# EAGLE design LEOPADMINI (EAGLE 9.4.2)
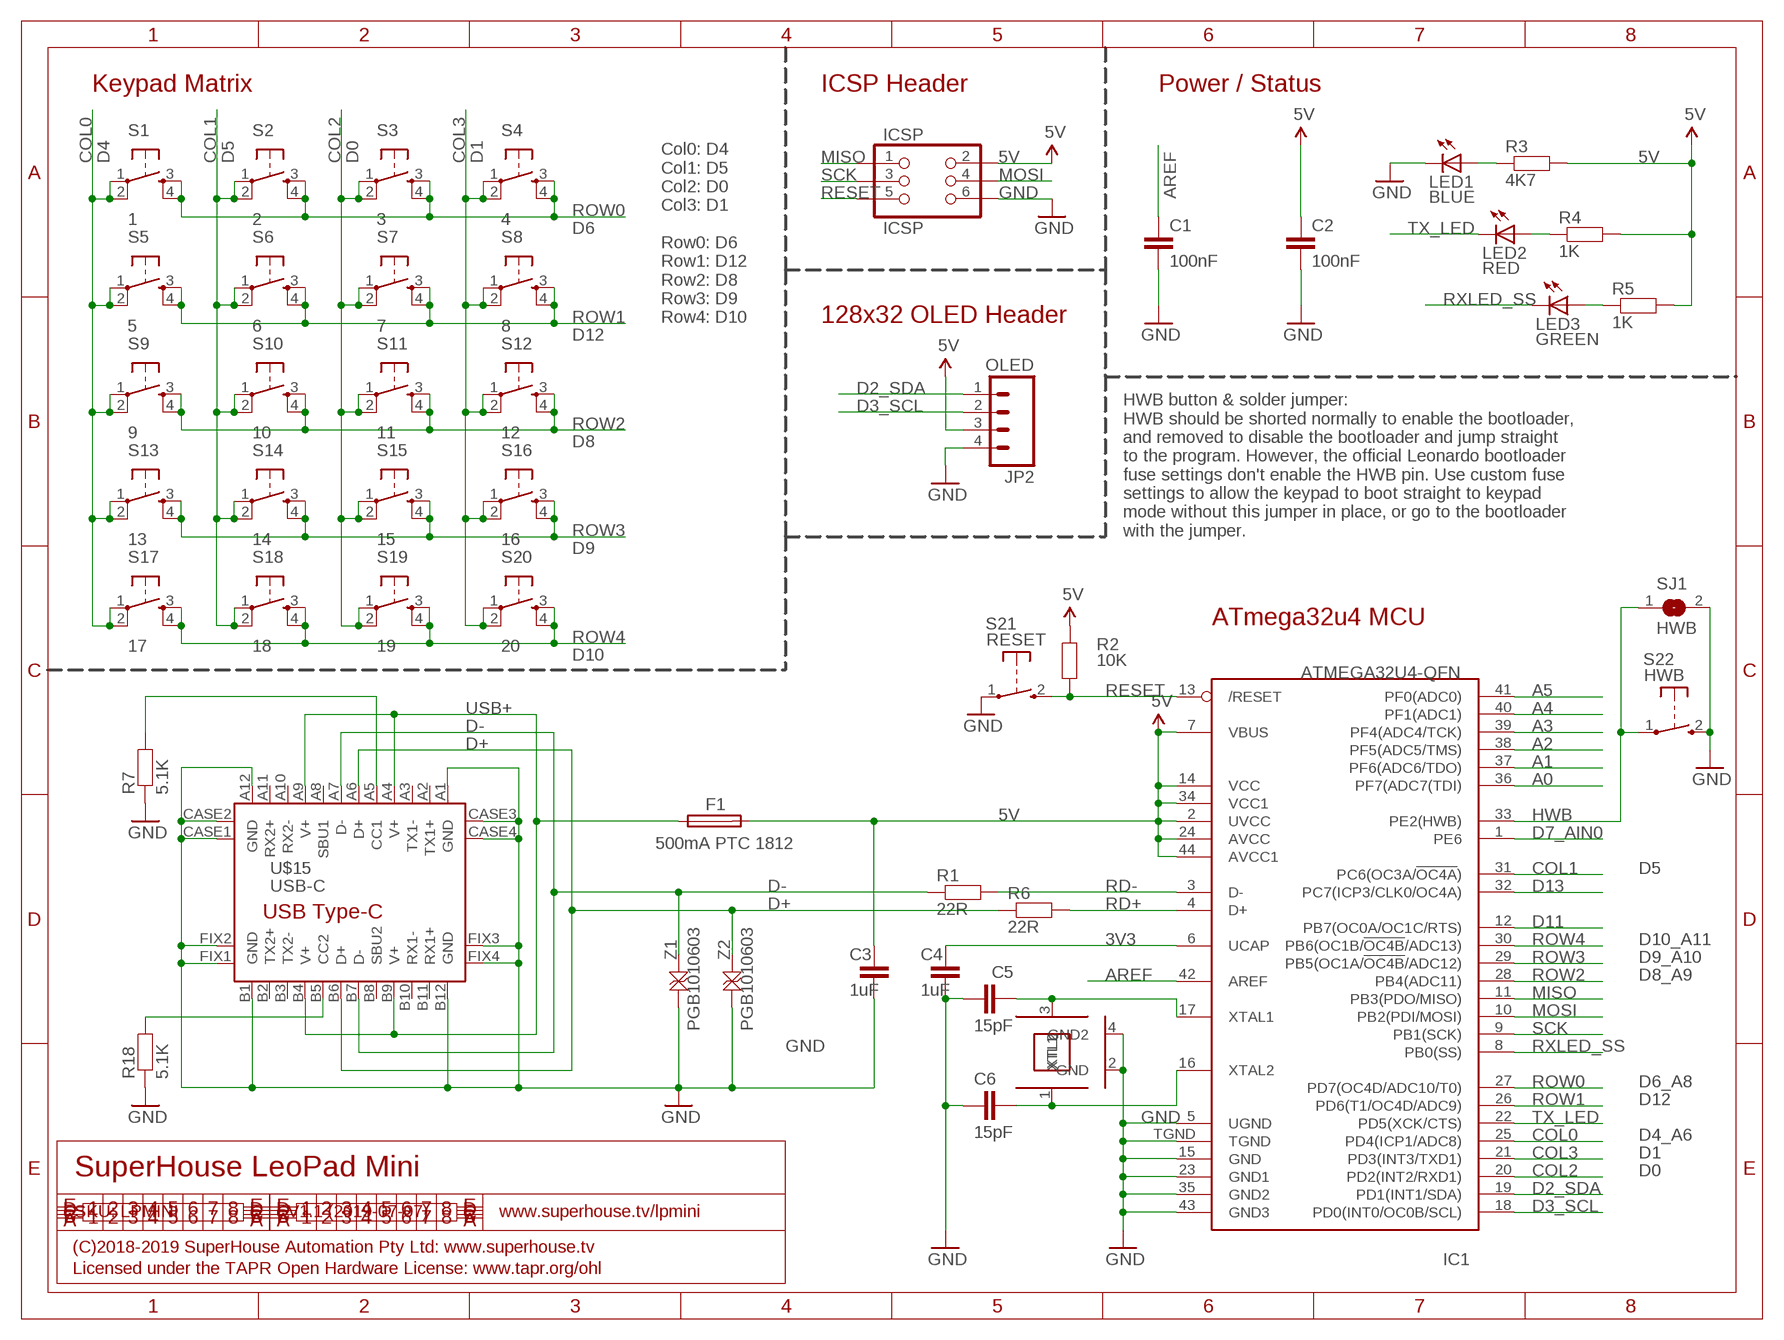
[diagram p0: schematic, sheet 1]

## Parts
C1  100nF  CAP0603  [C0603]
C2  100nF  CAP0603  [C0603]
C3  1uF  CAP0603  [C0603]
C4  1uF  CAP0603  [C0603]
C5  15pF  CAP0603  [C0603]
C6  15pF  CAP0603  [C0603]
F1  500mA PTC 1812  PTC050  [1812]
IC1  ATMEGA32U4-QFN  [QFN-44N]
ICSP  ICSP  ICSPPTH  [2X03PTH]
JP2  OLED  M04PTH  [1X04]
LED1  BLUE  LED0603  [LED-0603]
LED2  RED  LED0603  [LED-0603]
LED3  GREEN  LED0603  [LED-0603]
R1  22R  RESISTOR0603  [R0603]
R2  10K  RESISTOR0603  [R0603]
R3  4K7  RESISTOR0603  [R0603]
R4  1K  RESISTOR0603  [R0603]
R5  1K  RESISTOR0603  [R0603]
R6  22R  RESISTOR0603  [R0603]
R7  5.1K  RESISTOR0603  [R0603]
R18  5.1K  RESISTOR0603  [R0603]
S1  1  TAC_SWITCH-PTH-6  [TACTILE-PTH-6MM]
S2  2  TAC_SWITCH-PTH-6  [TACTILE-PTH-6MM]
S3  3  TAC_SWITCH-PTH-6  [TACTILE-PTH-6MM]
S4  4  TAC_SWITCH-PTH-6  [TACTILE-PTH-6MM]
S5  5  TAC_SWITCH-PTH-6  [TACTILE-PTH-6MM]
S6  6  TAC_SWITCH-PTH-6  [TACTILE-PTH-6MM]
S7  7  TAC_SWITCH-PTH-6  [TACTILE-PTH-6MM]
S8  8  TAC_SWITCH-PTH-6  [TACTILE-PTH-6MM]
S9  9  TAC_SWITCH-PTH-6  [TACTILE-PTH-6MM]
S10  10  TAC_SWITCH-PTH-6  [TACTILE-PTH-6MM]
S11  11  TAC_SWITCH-PTH-6  [TACTILE-PTH-6MM]
S12  12  TAC_SWITCH-PTH-6  [TACTILE-PTH-6MM]
S13  13  TAC_SWITCH-PTH-6  [TACTILE-PTH-6MM]
S14  14  TAC_SWITCH-PTH-6  [TACTILE-PTH-6MM]
S15  15  TAC_SWITCH-PTH-6  [TACTILE-PTH-6MM]
S16  16  TAC_SWITCH-PTH-6  [TACTILE-PTH-6MM]
S17  17  TAC_SWITCH-PTH-6  [TACTILE-PTH-6MM]
S18  18  TAC_SWITCH-PTH-6  [TACTILE-PTH-6MM]
S19  19  TAC_SWITCH-PTH-6  [TACTILE-PTH-6MM]
S20  20  TAC_SWITCH-PTH-6  [TACTILE-PTH-6MM]
S21  RESET  TAC_SWITCH_2PINSMT  [TACTILE_SMD_3X4X2]
S22  HWB  TAC_SWITCH_2PINSMT  [TACTILE_SMD_3X4X2]
SJ1  HWB  SJN  [SJ]
U$15  USB-C  [USB-C-U52A]
XTL1  16MHz  CRYSTAL-GND3X2  [CRYSTAL-SMD-3X2]
Z1  PGB1010603  TVS0603  [TVS0603]
Z2  PGB1010603  TVS0603  [TVS0603]

## Nets
3V3: C4.2 IC1.6(UCAP)
5V: C2.1 C3.1 F1.2 IC1.2(UVCC) IC1.7(VBUS) IC1.14(VCC) IC1.24(AVCC) IC1.34(VCC1) IC1.44(AVCC1) ICSP.2 JP2.3 R2.2 R3.2 R4.2 R5.2
A0: IC1.36(PF7(ADC7(TDI))
A1: IC1.37(PF6(ADC6/TDO))
A2: IC1.38(PF5(ADC5/TMS))
A3: IC1.39(PF4(ADC4/TCK))
A4: IC1.40(PF1(ADC1))
A5: IC1.41(PF0(ADC0))
AREF: C1.1 IC1.42(AREF)
COL0: IC1.25(PD4(ICP1/ADC8)) S1.1 S1.2 S5.1 S5.2 S9.1 S9.2 S13.1 S13.2 S17.1 S17.2
COL1: IC1.31(PC6(OC3A/!OC4A!)) S2.1 S2.2 S6.1 S6.2 S10.1 S10.2 S14.1 S14.2 S18.1 S18.2
COL2: IC1.20(PD2(INT2/RXD1)) S3.1 S3.2 S7.1 S7.2 S11.1 S11.2 S15.1 S15.2 S19.1 S19.2
COL3: IC1.21(PD3(INT3/TXD1)) S4.1 S4.2 S8.1 S8.2 S12.1 S12.2 S16.1 S16.2 S20.1 S20.2
D2_SDA: IC1.19(PD1(INT1/SDA)) JP2.1
D3_SCL: IC1.18(PD0(INT0/OC0B/SCL)) JP2.2
D7_AIN0: IC1.1(PE6)
D11: IC1.12(PB7(OC0A/OC1C/RTS))
D13: IC1.32(PC7(ICP3/CLK0/OC4A))
D+: R6.1 U$15.A6(D+) U$15.B6(D+) Z2.2
D-: R1.1 U$15.A7(D-) U$15.B7(D-) Z1.2
GND: C1.2 C2.2 C3.2 C4.1 C5.1 C6.1 IC1.5(UGND) IC1.15(GND) IC1.23(GND1) IC1.35(GND2) IC1.43(GND3) IC1.TGND ICSP.6 JP2.4 LED1.C R7.1 R18.1 S21.1(P) S22.2(S) SJ1.2 U$15.A1(GND) U$15.A12(GND) U$15.B1(GND) U$15.B12(GND) U$15.CASE1(GND) U$15.CASE2(GND) U$15.CASE3(GND) U$15.CASE4(GND) U$15.FIX1(GND) U$15.FIX2(GND) U$15.FIX3(GND) U$15.FIX4(GND) XTL1.2(GND) XTL1.4(GND2) Z1.1 Z2.1
HWB: IC1.33(PE2(HWB)) S22.1(P) SJ1.1
MISO: IC1.11(PB3(PDO/MISO)) ICSP.1
MOSI: IC1.10(PB2(PDI/MOSI)) ICSP.4
N$1: R18.2 U$15.B5(CC2)
N$6: LED1.A R3.1
N$7: LED2.A R4.1
N$8: LED3.A R5.1
N$11: C5.2 IC1.17(XTAL1) XTL1.3(XTL2)
N$12: C6.2 IC1.16(XTAL2) XTL1.1(XTL1)
N$67: R7.2 U$15.A5(CC1)
RD+: IC1.4(D+) R6.2
RD-: IC1.3(D-) R1.2
RESET: IC1.13(/RESET) ICSP.5 R2.1 S21.2(S)
ROW0: IC1.27(PD7(OC4D/ADC10/T0)) S1.3 S1.4 S2.3 S2.4 S3.3 S3.4 S4.3 S4.4
ROW1: IC1.26(PD6(T1/OC4D/ADC9)) S5.3 S5.4 S6.3 S6.4 S7.3 S7.4 S8.3 S8.4
ROW2: IC1.28(PB4(ADC11)) S9.3 S9.4 S10.3 S10.4 S11.3 S11.4 S12.3 S12.4
ROW3: IC1.29(PB5(OC1A/!OC4B!/ADC12)) S13.3 S13.4 S14.3 S14.4 S15.3 S15.4 S16.3 S16.4
ROW4: IC1.30(PB6(OC1B/!OC4B!/ADC13)) S17.3 S17.4 S18.3 S18.4 S19.3 S19.4 S20.3 S20.4
RXLED_SS: IC1.8(PB0(SS)) LED3.C
SCK: IC1.9(PB1(SCK)) ICSP.3
TX_LED: IC1.22(PD5(XCK/CTS)) LED2.C
USB+: F1.1 U$15.A4(V+) U$15.A9(V+) U$15.B4(V+) U$15.B9(V+)
Unconnected: U$15.A2(TX1+) U$15.A3(TX1-) U$15.A8(SBU1) U$15.A10(RX2-) U$15.A11(RX2+) U$15.B2(TX2+) U$15.B3(TX2-) U$15.B8(SBU2) U$15.B10(RX1-) U$15.B11(RX1+)

## Notes on the sheet
- Keypad Matrix | ICSP Header | Power / Status
- D4 | D5 | D0 | D1
- D6
- Col0: D4
  Col1: D5
  Col2: D0
  Col3: D1
  
  Row0: D6
  Row1: D12
  Row2: D8
  Row3: D9
  Row4: D10
- 128x32 OLED Header
- D12
- D8
- HWB button & solder jumper:
  HWB should be shorted normally to enable the bootloader,
  and removed to disable the bootloader and jump straight
  to the program. However, the official Leonardo bootloader
  fuse settings don't enable the HWB pin. Use custom fuse
  settings to allow the keypad to boot straight to keypad
  mode without this jumper in place, or go to the bootloader
  with the jumper.
- D9
- ATmega32u4 MCU
- D10
- D5
- D10_A11
- D9_A10
- D8_A9
- D6_A8
- D12
- D4_A6
- D1
- SuperHouse LeoPad Mini | D0
- SKU: LPMINI | V1.1 (2019-07-07) | www.superhouse.tv/lpmini
- (C)2018-2019 SuperHouse Automation Pty Ltd: www.superhouse.tv
- Licensed under the TAPR Open Hardware License: www.tapr.org/ohl

## Library data of the parts
C1-C6 = SuperHouse-DiscreteSemi:CAP: Capacitor Standard ceramic capacitor
F1 = SuperHouse-Fuses:PTC: MF-SMDF Series - PRC Resettable Fuses Source: http://www.farnell.com/datasheets/716597.pdf
IC1 = freetronics-jon:ATMEGA32U4: ATMEGA32U4
ICSP = SuperHouse-Connectors:ICSP
JP2 = freetronics-jon:M04: Header 4 Standard 4-pin 0.1" header. Use with straight break away headers (SKU : PRT-00116), right angle break away headers (PRT-00553), swiss pins (PRT-00743), machine pins (PRT-00117), and female headers (PRT-00115). Molex polarized connector foot print use with SKU : PRT-08231 with associated crimp pins and housings. 1MM SMD Version SKU: PRT-10208
LED1-LED3 = SuperHouse-LEDs:LED: LEDs Standard schematic elements and footprints for 5mm, 3mm, 1206, and 0603 sized LEDs. 5mm - Spark Fun Electronics SKU : COM-00529 (and others)
R1-R7 R18 = SuperHouse-DiscreteSemi:RESISTOR: Resistor Standard resistors.
S1 = SuperHouse-Switches:TAC_SWITCH: Momentary Switch Tactile switch, normally-open.; SPICEPREFIX: S
S2-S20 = SuperHouse-Switches:TAC_SWITCH: Momentary Switch Tactile switch, normally-open.
S21 S22 = SuperHouse-Switches:TAC_SWITCH_2PIN: Momentary Tactile Switch - 2 pin Uxcell 3x4x2mm switch with 2 SMT pads
SJ1 = freetronics-jon:SJ: SMD solder JUMPER
U$15 = SuperHouse-Connectors:USB-C
XTL1 = SuperHouse-Oscillators:CRYSTAL-GND: 3x2mm SMT crystal
Z1 Z2 = SuperHouse-DiscreteSemi:TVS: TVS voltage protection Zener

## Net classes
0 default: width 0.152 mm, drill 0.241 mm, clearance 0.152 mm

## Board
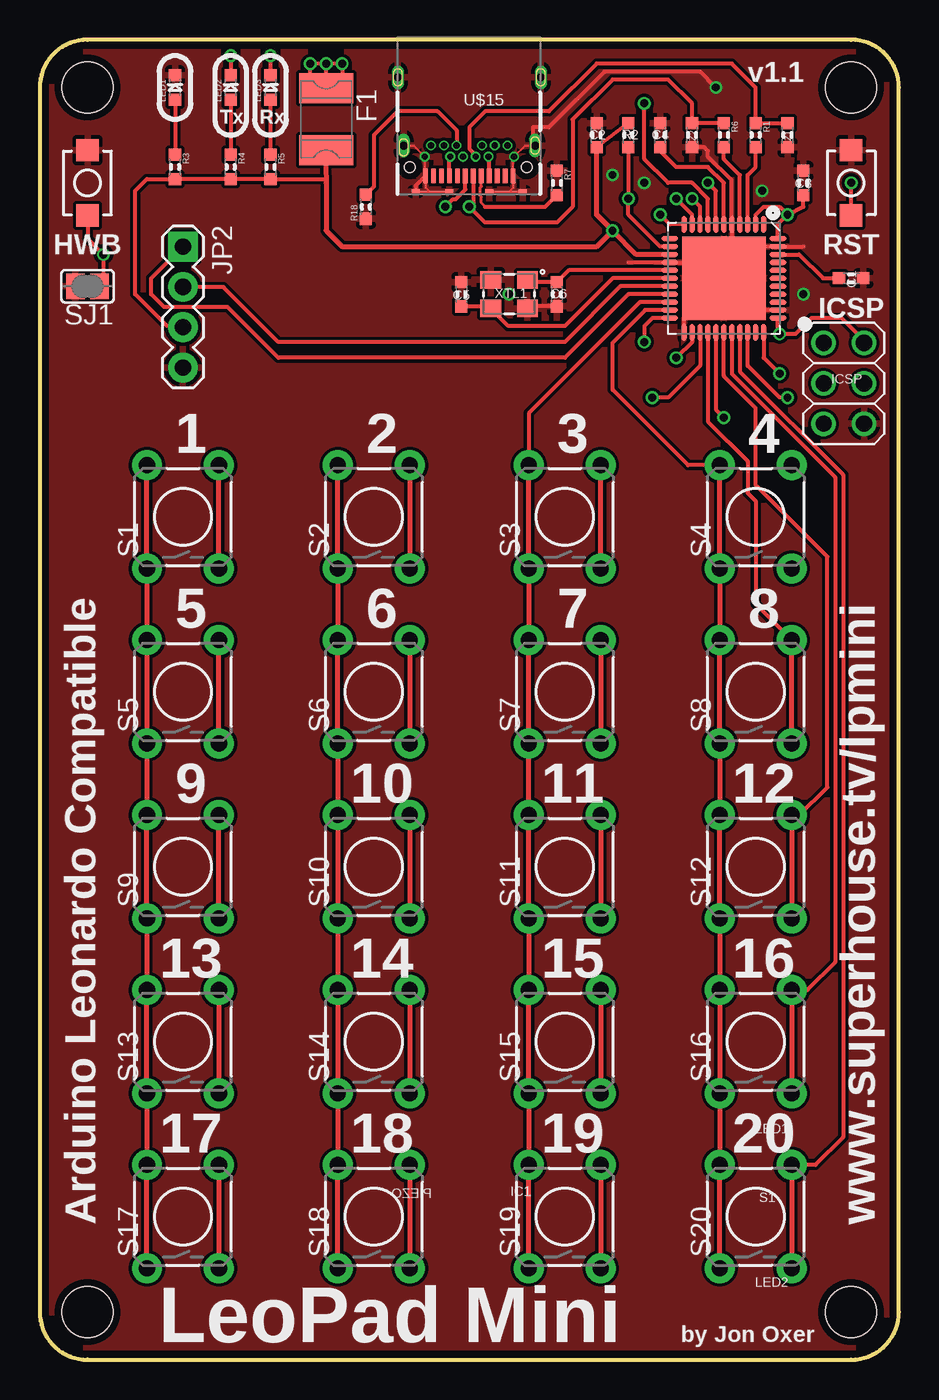
[diagram p1: board, top side]
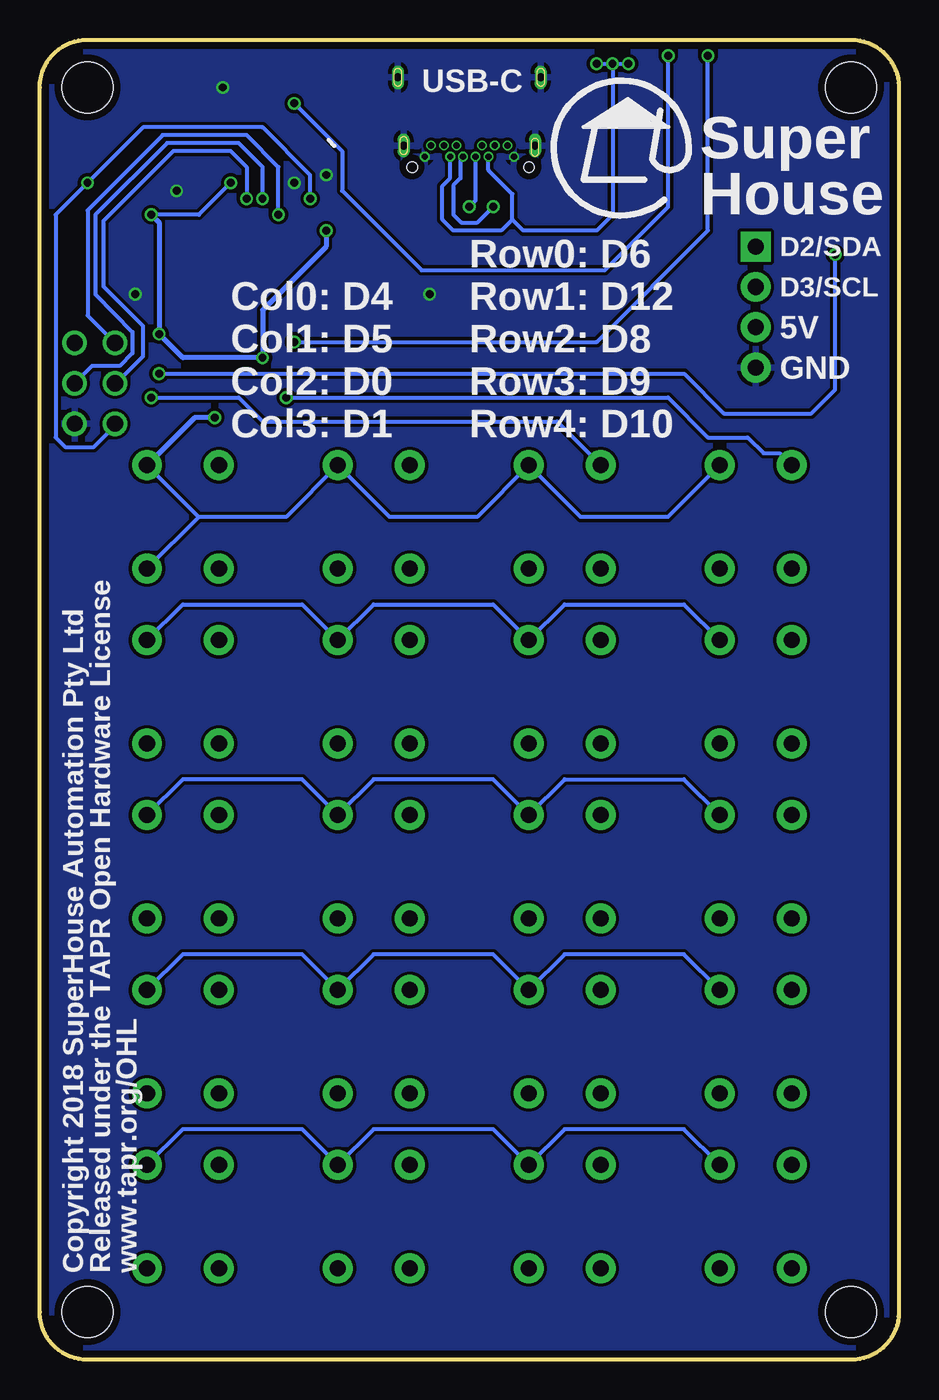
[diagram p2: board, bottom side, seen from below]

Size 54 x 83 mm. Coordinates in mm from the lower left corner, seen from the top.
Outline: 54,3 54,80 arc90 51,83 3,83 arc90 0,80 0,3 arc90 3,0 51,0 arc90 54,3
Copper layers (1*16): Top 0.035mm / dielectric 1.5mm / Bottom 0.035mm
Design rules "freetronics-design-rules": minimum track width 8mil, minimum drill 15mil, track to track 8mil, track to pad 8mil, pad to pad 8mil, via to via 8mil, smd to smd 6mil, copper to edge 18mil, drill to drill 8mil, minimum pad ring 4mil, minimum via ring 6mil, stop-mask expansion 4mil, vias tented up to drill 25mil, thermal gap 10mil
Holes 3.2 mm at 3,80 51,80 3,3 51,3

### Footprints (pad centres in the part's own frame; a part is rotated, then mirrored left to right if it is on the bottom)
C0603 = smd 0.762 x 0.762: 1 -0.762,0; 2 0.762,0
1812 = smd 1.9 x 3.4: 1 -1.95,0; 2 1.95,0
QFN-44N = smd 0.3 x 1.05: 1 -2.5,-3.4; 2 -2,-3.4; 3 -1.5,-3.4; 4 -1,-3.4; 5 -0.5,-3.4; 6 0,-3.4; 7 0.5,-3.4; 8 1,-3.4; 9 1.5,-3.4; 10 2,-3.4; 11 2.5,-3.4; 23 2.5,3.4; 24 2,3.4; 25 1.5,3.4; 26 1,3.4; 27 0.5,3.4; 28 0,3.4; 29 -0.5,3.4; 30 -1,3.4; 31 -1.5,3.4; 32 -2,3.4; 33 -2.5,3.4 | smd 1.05 x 0.3: 12 3.4,-2.5; 13 3.4,-2; 14 3.4,-1.5; 15 3.4,-1; 16 3.4,-0.5; 17 3.4,0; 18 3.4,0.5; 19 3.4,1; 20 3.4,1.5; 21 3.4,2; 22 3.4,2.5; 34 -3.4,2.5; 35 -3.4,2; 36 -3.4,1.5; 37 -3.4,1; 38 -3.4,0.5; 39 -3.4,0; 40 -3.4,-0.5; 41 -3.4,-1; 42 -3.4,-1.5; 43 -3.4,-2; 44 -3.4,-2.5 | smd 5.25 x 5.25: TGND 0,0
2X03PTH = drill 1.016: 1 -2.54,-1.27; 2 -2.54,1.27; 3 0,-1.27; 4 0,1.27; 5 2.54,-1.27; 6 2.54,1.27
1X04 = drill 1.016 pad 1.88 square: 1 0,0 | drill 1.016 pad 1.88: 2 2.54,0; 3 5.08,0; 4 7.62,0
LED-0603 = smd 0.762 x 0.762: A -0.762,0; C 0.762,0
R0603 = smd 0.762 x 0.762: 1 -0.762,0; 2 0.762,0
TACTILE-PTH-6MM = drill 1.016 pad 1.88: 1 -3.251,2.261; 2 3.251,2.261; 3 -3.251,-2.261; 4 3.251,-2.261
TACTILE_SMD_3X4X2 = smd 1.4 x 1.4: 1 -2.05,0; 2 2.05,0
SJ = smd 1.168 x 1.6: 1 -0.762,0; 2 0.762,0
USB-C-U52A = smd 0.3 x 0.9: A1 0.85,0.56; A2 1.35,0.56; A3 1.85,0.56; A4 2.35,0.56; A5 2.85,0.56; A6 3.35,0.56; A7 3.85,0.56; A8 4.35,0.56; A9 4.85,0.56; A10 5.35,0.56; A11 5.85,0.56; A12 6.35,0.56 | drill 0.4 pad 0.6: B1 6.4,-0.65; B2 6,-1.35; B3 5.2,-1.35; B4 4.8,-0.65; B5 4.4,-1.35; B6 4,-0.65; B7 3.2,-0.65; B8 2.8,-1.35; B9 2.4,-0.65; B10 2,-1.35; B11 1.2,-1.35; B12 0.8,-0.65 | smd 0.5 x 0.3: CASE1 0.23,1.55; CASE2 2.35,1.55; CASE3 4.85,1.55; CASE4 6.98,1.55 | drill 0.5 pad 0.7 long: FIX1 -0.89,-5.64; FIX2 -0.53,-1.35; FIX3 7.73,-1.35; FIX4 8.09,-5.64 | hole 0.65: 7.35,0; 0,0
CRYSTAL-SMD-3X2 = smd 1.3 x 1.1: 1 -1.15,-0.9; 2 1.15,-0.9; 3 1.15,0.9; 4 -1.15,0.9
TVS0603 = smd 0.762 x 0.762: 1 -0.762,0; 2 0.762,0

### Placement (x,y rotation side)
C1  51,68 0 top
C2  35,77 90 top
C3  48,74 90 top
C4  39,77 270 top
C5  26.5,67 270 top
C6  32.5,67 90 top
F1  18,78 270 top
IC1  43,68 180 top
ICSP  50.54,61.4 270 top
JP2  9,70 270 top
LED1  8.5,80 90 top
LED2  12,80 90 top
LED3  14.5,80 90 top
R1  45,77 270 top
R2  37,77 90 top
R3  8.5,75 270 top
R4  12,75 270 top
R5  14.5,75 270 top
R6  43,77 270 top
R7  32.5,74 270 top
R18  20.5,72.5 90 top
S1  9,53 90 top
S2  21,53 90 top
S3  33,53 90 top
S4  45,53 90 top
S5  9,42 90 top
S6  21,42 90 top
S7  33,42 90 top
S8  45,42 90 top
S9  9,31 90 top
S10  21,31 90 top
S11  33,31 90 top
S12  45,31 90 top
S13  9,20 90 top
S14  21,20 90 top
S15  33,20 90 top
S16  45,20 90 top
S17  9,9 90 top
S18  21,9 90 top
S19  33,9 90 top
S20  45,9 90 top
S21  51,74 270 top
S22  3,74 90 top
SJ1  3,67.5 180 top
U$15  30.6,75 180 top
XTL1  29.5,67 180 top
Z1  47,77 90 top
Z2  41,77 90 top

### Tracks (layer width: path | path; a pad name or v marks a point on that pad's centre or on a via)
3V3
  Top 0.254: IC1.6 43,74 42,75 40,75 39,76 C4.2
5V  (via drill 0.5)
  Top 0.254: IC1.7 42.5,73.5 v42,74 | IC1.24 41,64 v40,63 | JP2.3 8.92,65 8,65 6,67 6,73.5 6.74,74.24 R3.2 R4.2 R5.2 18,74.24 18,74 | ICSP.2 52.06,63.84 50.4,65.5 48.5,65.5 47.5,64.5 v46.5,64.5 46.4,64.6 IC1.34 | v47,72 48,72.5 C3.1 | IC1.44 46.4,71.4 v47,72 | IC1.2 45,72 45.5,72.5 46.5,72.5 v47,72 | R2.2 C2.1
  Top 0.305: IC1.14 37.5,69.5 v36,71 | v36,71 35,72 C2.1 | F1.2 17.95,76 18,74 18,71 19,70 35,70 v36,71
  Bottom 0.254: v42,74 44,72 v47,72
  Bottom 0.305: v47,72 46.5,71.5 v46.5,64.5 45,63 v40,63 40,66 36,70 v36,71
AREF
  Top 0.254: IC1.42 47.74,69.5 49.24,68 C1.1
COL0  (via drill 0.5)
  Top 0.254: IC1.25 41.5,62.5 39.5,60.5 v38.5,60.5
  Top 0.305: S1.2 S1.1 S5.2 S5.1 S9.2 S9.1 S13.2 S13.1 S17.2 S17.1
  Bottom 0.254: v38.5,60.5 14.5,60.5 12,58 9.5,58 8.5,57 7.5,57 S1.2
COL1  (via drill 0.5)
  Top 0.254: v47,60.5 46.5,60.5 44.5,62.5 IC1.31
  Top 0.305: S2.2 S2.1 S6.2 S6.1 S10.2 S10.1 S14.2 S14.1 S18.2 S18.1
  Bottom 0.254: v47,60.5 41.5,60.5 40,59 21.49,59 S2.2
COL2
  Top 0.254: IC1.20 37.72,66.5 30.74,59.52 S3.2
  Top 0.305: S3.2 S3.1 S7.2 S7.1 S11.2 S11.1 S15.2 S15.1 S19.2 S19.1
COL3
  Top 0.254: IC1.21 38.05,66 36,63.95 36,61 40.75,56.25 S4.2 42.76,54.24
  Top 0.305: S4.2 S4.1 S8.2 S8.1 S12.2 S12.1 S16.2 S16.1 S20.2 S20.1
D2_SDA
  Top 0.254: IC1.19 37,67 33,63 15,63 11.81,66.19 7.81,66.19 7,67 7,68 JP2.1
D3_SCL
  Top 0.254: IC1.18 36.5,67.5 33,64 15,64 11.54,67.46 JP2.2
D+  (via drill 0.5)
  Top 0.254: R6.1 Z2.2 41,79 39.5,80.5 36,80.5 33.5,78 33.5,72.5 32.5,71.5 28,71.5 v27,72.5 27.25,72.75 U$15.A6
  Bottom 0.254: v27,72.5 26.6,72.9 U$15.B6
D-  (via drill 0.5)
  Top 0.254: Z1.2 R1.1 45,80 43.5,81.5 35,81.5 32,78.5 28,78.5 27,77.5 27,76.14 27.23,75.91 27.23,75.82 U$15.B7 | v25.5,72.5 25.97,72.97 26.14,72.97 26.75,73.58 U$15.A7
  Bottom 0.254: U$15.B7 27.57,75.48 27.57,74.28 28,73.85 28,72 27.5,71.5 26.5,71.5 v25.5,72.5
GND  (via drill 0.5, 0.5 pad 0.5)
  Top 0.152: 24.2,74.49 U$15.B1 23.5,76.35 U$15.FIX3 | U$15.FIX2 30.5,76.35 U$15.B12 29.74,75.59 29.74,74.64 29.75,74.64 U$15.A1 29.75,73.7 29.5,73.45 | U$15.CASE2 29.5,73.45 | 29.5,73.45 U$15.CASE1 | U$15.CASE3 24.5,73.45 | 24.5,73.45 U$15.CASE4 | U$15.A12 24.25,73.7 24.5,73.45
  Top 0.254: IC1.35 45,66 IC1.TGND | 43.5,70 IC1.5 43.48,71.42 43.48,74.17 42,75.65 42,76 41.76,76.24 Z2.1 | 43.5,70 43.5,68.5 IC1.TGND | IC1.TGND 42,69 IC1.15 37,69 | 43.5,70 IC1.43 48,70 | IC1.23 40.5,66.5 42,68 IC1.TGND | C6.1 30.79,66.24 XTL1.4 | U$15.A12 23.62,73.81 U$15.CASE4 | v42.5,80 41.5,81 35.5,81 32,77.5 31,77.5 31,76.48 U$15.FIX2
  other vias: 29.5,67 48,67 45.4,73.5 36,74.5 38,74
  pour Bottom: 0,80 arc-90 3,83 51,83 arc-90 54,80 54,3 arc-74 51,0 3,0 arc-74 0,3
  pour Top: 0,80 arc-90 3,83 51,83 arc-90 54,80 54,3 arc-74 51,0 3,0 arc-74 0,3
HWB  (via drill 0.5)
  Top 0.254: IC1.33 45.5,63 v46.5,62 | SJ1.1 4,67.74 v4,69.5 3,70.5 S22.1
  Bottom 0.254: v46.5,62 13.5,62 11,59.5 5.5,59.5 4,61 v4,69.5
MISO  (via drill 0.5)
  Top 0.254: IC1.11 39.6,71.4 v39,72
  Bottom 0.254: v39,72 39,75 41,77 46.28,77 51,72.28 51,65.67 ICSP.1
MOSI  (via drill 0.5)
  Top 0.254: IC1.10 41,72 v40,73
  Bottom 0.254: v40,73 40,75 41.5,76.5 46,76.5 50.5,72 50.5,66.99 48.18,64.62 48.18,63.28 48.97,62.49 50.72,62.49 51.53,61.68 51.52,61.69 ICSP.4
N$1
  Top 0.254: U$15.B5 26.2,77.3 25,78.5 22.5,78.5 21,77 21,73.76 R18.2
N$6
  Top 0.254: LED1.A R3.1
N$7
  Top 0.254: LED2.A R4.1
N$8
  Top 0.254: LED3.A R5.1
N$11
  Top 0.254: IC1.17 36,68 33,65 29.45,65 XTL1.3 28.21,66.24 C5.2
N$12
  Top 0.254: XTL1.1 30.79,67.76 C6.2 33.24,68.5 IC1.16
N$67
  Top 0.203: 28,72.5 27.75,72.75 27.75,73.12 27.7,73.17 27.7,73.73 27.75,73.78 U$15.A5
  Top 0.254: R7.2 31.76,72.5 28,72.5
RD+
  Top 0.254: IC1.4 44,74.5 43,75.5 R6.2
RD-
  Top 0.254: IC1.3 44.5,74.5 45,75 R1.2
RESET  (via drill 0.5)
  Top 0.254: IC1.13 39,70 37,72 v37,73 R2.1 | S21.2 v51,74
  Bottom 0.254: v37,73 37,74.5 40,77.5 47.5,77.5 v51,74 53,72 53,58 52.4,57.4 50.6,57.4 49.42,58.58 ICSP.5
ROW0  (via drill 0.5)
  Top 0.254: IC1.27 42.5,59.75 v43,59.25
  Top 0.305: S1.3 S1.4 | S2.4 S2.3 | S3.3 S3.4
  Bottom 0.254: S1.4 14.51,53 20.01,53 S2.4 26.51,53 32.01,53 S3.4 38.51,53 44.01,53 | 44.01,53 S4.4 | 44.01,53 S4.3
  Bottom 0.305: v43,59.25 44.25,59.25 S4.4
ROW1
  Top 0.254: IC1.26 42,59 44.5,56.5 44.5,54.5 45,54 45,47.51 S8.4
  Top 0.305: S5.3 S5.4 | S8.3 S8.4 | S7.4 S7.3 | S6.4 S6.3
  Bottom 0.254: S5.4 13.51,47.5 21.01,47.5 S6.4 25.51,47.5 33.01,47.5 S7.4 37.51,47.5 45.01,47.5 S8.4
ROW2
  Top 0.254: IC1.28 43,61.85 45,59.85 45,55 49.5,50.5 49.5,36 47.75,34.25 S12.4
  Top 0.305: S9.3 S9.4 | S10.4 S10.3 | S11.4 S11.3 | S12.4 S12.3
  Bottom 0.254: S9.4 13.51,36.5 21.01,36.5 S10.4 25.51,36.5 33.01,36.5 S11.4 37.51,36.5 45.01,36.5 S12.4
ROW3
  Top 0.254: S16.4 48.25,23.25 50,25 50,55.5 43.5,62 IC1.29
  Top 0.305: S13.4 S13.3 | S14.4 S14.3 | S15.4 S15.3 | S16.4 S16.3
  Bottom 0.254: S13.4 13.51,25.5 21.01,25.5 S14.4 25.51,25.5 33.01,25.5 S15.4 37.51,25.5 45.01,25.5 S16.4
ROW4
  Top 0.254: S20.4 48.75,12.25 50.5,14 50.5,55.65 44,62.15 IC1.30
  Top 0.305: S20.4 S20.3 | S19.4 S19.3 | S18.4 S18.3 | S17.4 S17.3
  Bottom 0.254: S17.4 13.51,14.5 21.01,14.5 S18.4 25.51,14.5 33.01,14.5 S19.4 37.51,14.5 45.01,14.5 S20.4
RXLED_SS  (via drill 0.5)
  Top 0.254: IC1.8 42,73 41,74 39.5,74 38,75.5 v38,79 | v14.5,82 LED3.C
  Bottom 0.254: v38,79 35,76 35,73.5 30,68.5 18.5,68.5 14.5,72.5 v14.5,82
SCK  (via drill 0.5)
  Top 0.254: IC1.9 41.5,72.5 v41,73
  Bottom 0.254: v41,73 41,75 42,76 45.6,76 50,71.6 50,67.5 47.5,65 47.5,63.1 49.29,61.31 ICSP.3
TX_LED  (via drill 0.5)
  Top 0.254: IC1.22 38.5,65.5 38,65 v38,64 | v12,82 LED2.C
  Bottom 0.254: v38,64 19,64 12,71 v12,82
USB+  (via drill 0.5)
  Top 0.254: U$15.A9 25.75,75.6 U$15.B4 | U$15.A4 28.25,75.6 U$15.B9 | v18,81.5 v19,81.5 19,80 18.95,79.95 F1.1 17.05,79.95 17,80 v17,81.5 v18,81.5 | 18,80 v18,81.5
  Bottom 0.254: 24.3,71.7 25,71 28,71 28.7,71.7 28.7,73.8 28.2,74.3 U$15.B9 | v19,81.5 v18,81.5 | v18,81.5 18,72 19,71 23.6,71 24.3,71.7 | v18,81.5 v17,81.5 | 24.3,71.7 24.3,73.3 25.8,74.8 U$15.B4

### Text on the board
tPlace: v1.1 | Tx | Rx | HWB | RST | ICSP | 1 | 2 | 3 | 4 | 5 | 6 | 7 | 8 | 9 | 10 | 11 | 12 | 13 | 14 | 15 | 16 | 17 | 18 | 19 | 20 | Arduino Leonardo Compatible | www.superhouse.tv/lpmini | LeoPad Mini | by Jon Oxer
bPlace: USB-C | Super / House | D2/SDA | D3/SCL | 5V | GND | Row0: D6 / Row1: D12 / Row2: D8 / Row3: D9 / Row4: D10 | Col0: D4 / Col1: D5 / Col2: D0 / Col3: D1 | Copyright 2018 SuperHouse Automation Pty Ltd / Released under the TAPR Open Hardware License / www.tapr.org/OHL
tNames: LED1 | PIEZO | IC1 | S1 | LED2